# Altium schematic sheet Sheet2.SchDoc
size A4; SheetNumber: 1; SheetTotal: 1
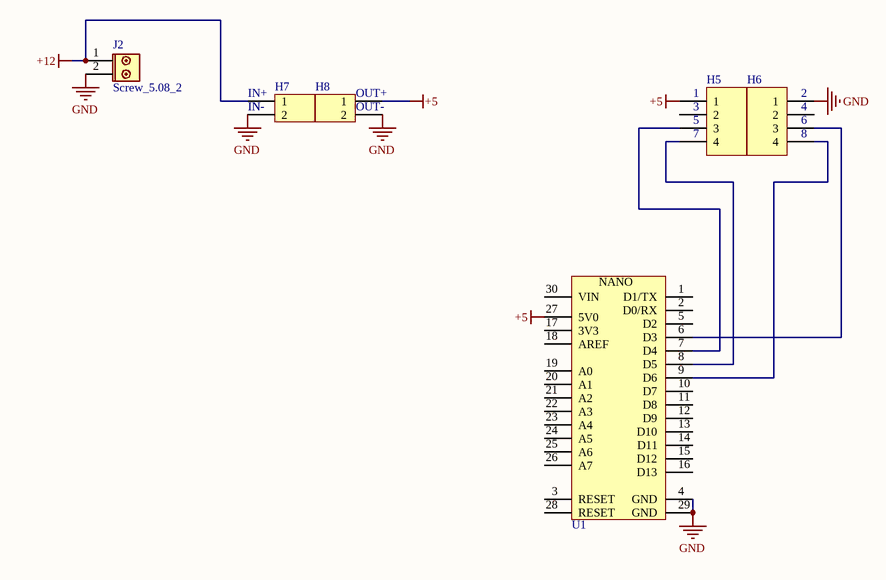
[diagram p0: Sheet2.SchDoc]

## Parts
H5  Header 4  [HDR1X4]  (value not drawn)
H6  Header 4  [HDR1X4]  (value not drawn)
H7  Header 2  [HDR1X2]  (value not drawn)
H8  Header 2  [HDR1X2]  (value not drawn)
J2  Screw_5.08_2  [ScrewTerm_2.54_2]
U1  Arduino Nano  [Arduino_NANO]  (value not drawn)

## Nets
+5: H5.1 H8.1 U1.27(5V0)
+12: H7.1 J2.1
GND: H6.1 H7.2 H8.2 J2.2 U1.4(GND) U1.29(GND)
NetH5_3: H5.3 U1.7(D4)
NetH5_4: H5.4 U1.8(D5)
NetH6_3: H6.3 U1.6(D3)
NetH6_4: H6.4 U1.9(D6)

Not connected (* = marked no-connect by the designer): H5 2; H6 2; U1 1(D1/TX) 2(D0/RX) 3(RESET) 5(D2) 10(D7) 11(D8) 12(D9) 13(D10) 14(D11) 15(D12) 16(D13) 17(3V3) 18(AREF) 19(A0) 20(A1) 21(A2) 22(A3) 23(A4) 24(A5) 25(A6) 26(A7) 28(RESET) 30(VIN)

## Notes on the sheet
- (near H7) IN+
- (near H8) OUT+
- (near H5) 1
- (near H6) 2
- (near H7) IN-
- (near H8) OUT-
- (near H5) 3
- (near H5) 5
- (near H5) 7
- (near H6) 4
- (near H6) 6
- (near H6) 8
- (in symbol Arduino Nano) NANO

## Library data of the parts
H5 H6 = Header 4: Header, 4-Pin; Manufacturer: Generic Components; Class: Connector
H7 H8 = Header 2: Header, 2-Pin; Manufacturer: Generic Components; Class: Connector
J2 = Screw_5.08_2: 2 way screw terminal connector
U1 = Arduino Nano: DIL Arduino Nano; Revision: 17-Jul-2002: Re-released for DXP Platform.; Publisher: Altium Limited